# EAGLE design Serial-Basic (EAGLE 7.6.0)
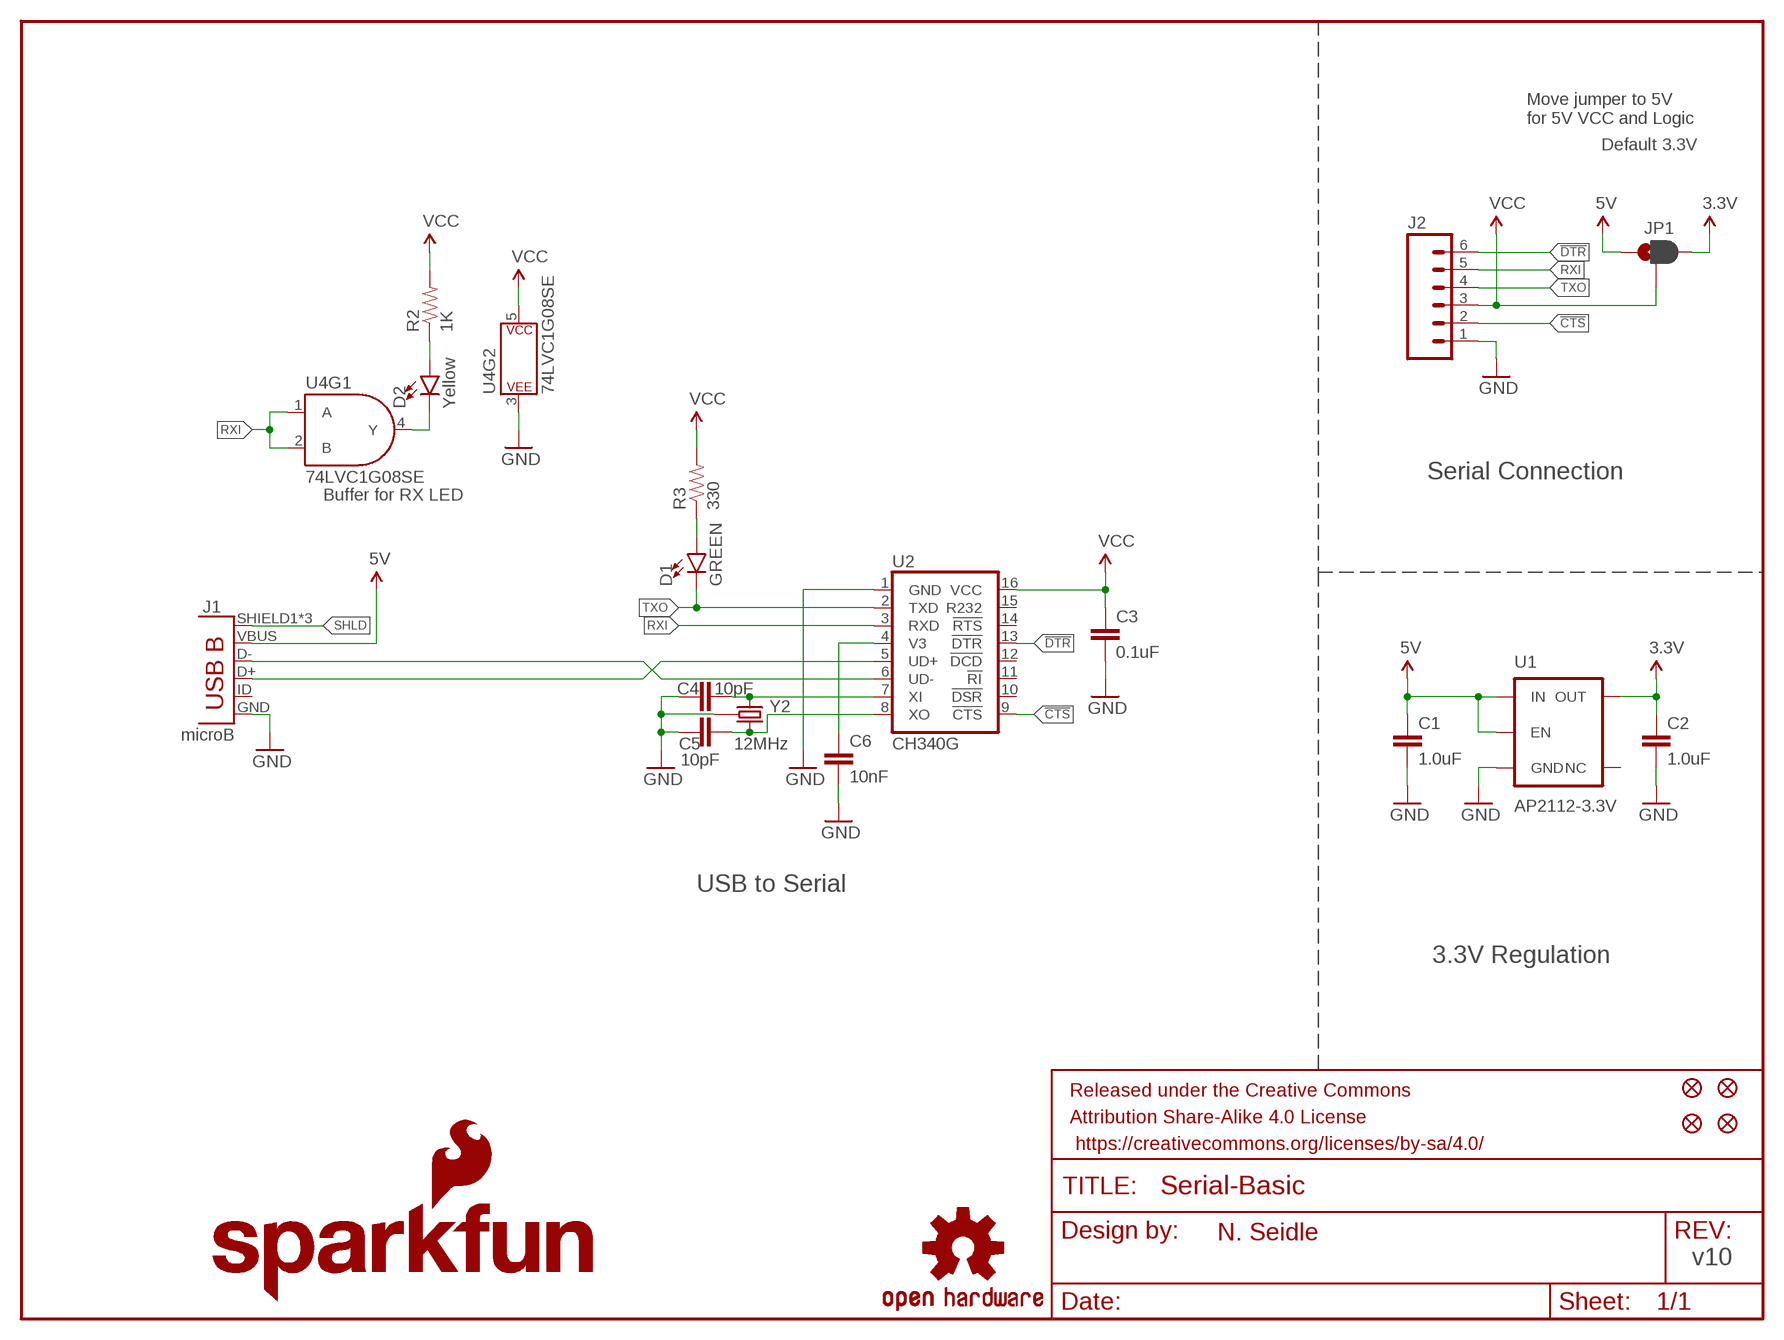
[diagram p0: schematic, sheet 1]

## Parts
C1  1.0uF  1.0UF-16V-10%(0603)  [0603-CAP]
C2  1.0uF  1.0UF-16V-10%(0603)  [0603-CAP]
C3  0.1uF  0.1UF-25V(+80/-20%)(0603)  [0603-CAP]
C4  10pF  10PF-50V-5%(0603)  [0603-CAP]
C5  10pF  10PF-50V-5%(0603)  [0603-CAP]
C6  10nF  10NF/10000PF-50V-10%(0603)  [0603-CAP]
D1  GREEN  LED-GREEN0603  [LED-0603]
D2  Yellow  LED-YELLOW0603  [LED-0603]
FRAME1  FRAME-LETTER  [CREATIVE_COMMONS]
J1  microB  USB-MICROB"  [USB-B-MICRO-SMD_V03]
J2  M06SMD-FEMALE-V2  [1X06-SMD-FEMALE-V2]
JP1  JUMPER-PAD-3-2OF3_NC_BY_PASTE  [PAD-JUMPER-3-2OF3_NC_BY_PASTE_YES_SILK_FULL_BOX]
JP3  FIDUCIAL1X2  [FIDUCIAL-1X2]
JP4  FIDUCIAL1X2  [FIDUCIAL-1X2]
JP5  FIDUCIAL1X2  [FIDUCIAL-1X2]
JP6  FIDUCIAL1X2  [FIDUCIAL-1X2]
LOGO1  OSHW-LOGOS  [OSHW-LOGO-S]
LOGO2  SFE_LOGO_FLAME.1_INCH  [SFE_LOGO_FLAME_.1]
LOGO3  SFE_LOGO_NAME.1_INCH  [SFE_LOGO_NAME_.1]
R2  1K  1KOHM-1/10W-1%(0603)  [0603-RES]
R3  330  330OHM1/10W1%(0603)  [0603-RES]
U1  AP2112-3.3V  V_REG_AP2112K-3.3V  [SOT23-5]
U2  CH340G  CH340GSMD  [SO016]
U4  74LVC1G08SE  7408  [SOT353]
Y2  12MHz  CRYSTAL-GROUNDED3.2X2.5  [CRYSTAL-SMD-3.2X2.5]

## Nets
3.3V [power]: C2.1 JP1.3 U1.5(OUT)
5V: C1.1 J1.VBUS JP1.1 U1.1(IN) U1.3(EN)
!CTS: J2.2 U2.9(!CTS)
!DTR: J2.6 U2.13(!DTR)
GND [power]: C1.2 C2.2 C3.2 C4.1 C5.1 C6.2 J1.GND J2.1 U1.2(GND) U2.1(GND) U4.3(P$V-) Y2.2(GND) Y2.4(GND)
N$1: D1.A R3.1
N$2: D2.A R2.1
N$3: C5.2 U2.8(XO) Y2.3
N$4: C4.2 U2.7(XI) Y2.1
N$5: D2.C U4.4(Y)
N$6: J1.D- U2.6(UD-)
N$7: J1.D+ U2.5(UD+)
RXI: J2.5 U2.3(RXD) U4.1(A) U4.2(B)
SHLD: J1.SHIELD1(SHIELD) J1.SHIELD2(SHIELD) J1.SHIELD3(SHIELD)
TXO: D1.C J2.4 U2.2(TXD)
V3: C6.1 U2.4(V3)
VCC: C3.1 J2.3 JP1.2 R2.2 R3.2 U2.16(VCC) U4.5(P$V+)
Unconnected: J1.ID(USBID) U1.4(NC) U2.10(!DSR) U2.11(!RI) U2.12(!DCD) U2.14(!RTS) U2.15(R232)

## Notes on the sheet
- Move jumper to 5V
  for 5V VCC and Logic
- Default 3.3V
- Serial Connection
- Buffer for RX LED
- USB to Serial
- 3.3V Regulation
- N. Seidle
- v10

## Library data of the parts
C1 C2 = SparkFun-Capacitors:1.0UF-16V-10%(0603): CAP-00868; PROD_ID: CAP-00868
C3 = SparkFun-Capacitors:0.1UF-25V(+80/-20%)(0603): CAP-00810 Ceramic Standard decoupling cap; PROD_ID: CAP-00810
C4 C5 = SparkFun-Capacitors:10PF-50V-5%(0603): CAP-11812; PROD_ID: CAP-11812
C6 = SparkFun-Capacitors:10NF/10000PF-50V-10%(0603): CAP-00867; PROD_ID: CAP-00867
D1 = SparkFun-LED:LED-GREEN: Green SMD LED Used in manufacturing of various products at SparkFun Packages: 0603 - SMD 0603 package [Product Link] <http://www.futureelectronics.com/en/technologies/semiconductors/optoelectronics/leds/Pages/9894312-LTST-C190GKT.aspx?CrossPart=HSMG-C190&IM=0> LilyPad 1206 - SMD1206 LilyPad package [Product Link] <http://www.futureelectronics.com/en/Technologies/Product.aspx?ProductID=IN150NGHARVATEKCORPORATION2049943&IM=0> 1206 - SMD1206 package [Product Link] <http://www.futureelectronics.com/en/technologies/semiconductors/optoelectronics/leds/Pages/8315665-LTST-C150KGKT.aspx?IM=0> 1206 Bottom Mount -SMD 1206 Bottom Mount [Product Link] <http://www.digikey.com/product-detail/en/lite-on-inc/LTST-C230KGKT/160-1456-1-ND/386854> SparkFun Products: Pro Mini 328 -5V <https://www.sparkfun.com/products/821> RedBoard <https://www.sparkfun.com/products/12757> MP3 Trigger <https://www.sparkfun.com/products/13720> Makey Makey <https://www.sparkfun.com/products/11076>; PROD_ID: DIO-00821
D2 = SparkFun-LED:LED-YELLOW: Yellow SMD LED Used in manufacturing several products at SparkFun. Packages: 0603 - SMD 0603 package[Product Link] <http://www.kingbrightusa.com/product.asp?catalog_name=LED&product_id=APT1608SYCK> 0603 -SMART - SMART SMD 0603 package (more efficient/more expensive) [Product Link] <http://www.osram-os.com/osram_os/en/products/product-catalog/led-light-emitting-diodes/smartled-0603/ly-l29k/index.jsp> LilyPad - SMD1206 package[Product Datasheet] <https://www.sparkfun.com/datasheets/DevTools/LilyPad/Q150YUS4.pdf> SparkFun Products: Blynk Board <https://www.sparkfun.com/products/13794> IOIO-OTG <https://www.sparkfun.com/products/13613> XBee Explorer Serial <https://www.sparkfun.com/products/13225>; PROD_ID: DIO-09003
FRAME1 = SparkFun-Aesthetics:FRAME-LETTER: Schematic Frame - Letter Standard 8.5x11 US Letter frame
J1 = SparkFun-Connectors:USB-MICROB; PROD_ID: CONN-11752
J2 = SparkFun-Connectors:M06: Header 6 Standard 6-pin 0.1" header. Use with straight break away headers (SKU : PRT-00116), right angle break away headers (PRT-00553), swiss pins (PRT-00743), machine pins (PRT-00117), and female headers (PRT-00115). Molex polarized connector foot print use with SKU : PRT-08094 with associated crimp pins and housings. NOTES ON THE VARIANTS LOCK and LOCK_LONGPADS... This footprint was designed to help hold the alignment of a through-hole component (i.e. 6-pin header) while soldering it into place. You may notice that each hole has been shifted either up or down by 0.005 of an inch from it's more standard position (which is a perfectly straight line). This slight alteration caused the pins (the squares in the middle) to touch the edges of the holes. Because they are alternating, it causes a "brace" to hold the component in place. 0.005 has proven to be the perfect amount of "off-center" position when using our standard breakaway headers. Although looks a little odd when you look at the bare footprint, once you have a header in there, the alteration is very hard to notice. Also,if you push a header all the way into place, it is covered up entirely on the bottom side. This idea of altering the position of holes to aid alignment will be further integrated into the Sparkfun Library for other footprints. It can help hold any component with 3 or more connection pins.; PROD_ID: CONN-09668
JP1 = SparkFun-Passives:JUMPER-PAD-3-2OF3_NC_BY_PASTE
JP3-JP6 = SparkFun:FIDUCIAL: Fiducial Alignment Points Various fiducial points for machine vision alignment.
LOGO1 = SparkFun-Aesthetics:OSHW-LOGO: Open-Source Hardware (OSHW) Logo This logo indicates the piece of hardware it is found on incorporates a OSHW license and/or adheres to the definition of open source hardware found here: http://freedomdefined.org/OSHW
LOGO2 = SparkFun-Aesthetics:SFE_LOGO_FLAME: SparkFun Flame Logo This is the SparkFun flame logo. The logo on the schematic will always be the same size; the package variant is the height of the flame. Default layer for the logo on the board is tSilk.
LOGO3 = SparkFun-Aesthetics:SFE_LOGO_NAME: SparkFun Font Logo This is the SparkFun name logo. The logo on the schematic will always be the same size; the package variant is the height of the flame part of the logo (or the height the flame would be, if it were drawn). Default layer for the logo on the board is tSilk.
R2 = SparkFun-Resistors:1KOHM-1/10W-1%(0603): RES-07856; PROD_ID: RES-07856
R3 = SparkFun-Resistors:330OHM1/10W1%(0603): RES-00818; PROD_ID: RES-00818
U1 = SparkFun-PowerIC:V_REG_AP2112: AP2112 - 600mA CMOS LDO Regulator w/ Enable The AP2112 is CMOS process low dropout linear regulator with enable function, the regulator delivers a guaranteed 600mA (min.) continuous load current. Features Output Voltage Accuracy: ±1.5% Output Current: 600mA (Min.) Foldback Short Current Protection: 50mA Enable Function to Turn ON/OFF VOUT Low Dropout Voltage (3.3V): 250mV (Typ.) @IOUT=600mA Excellent Load Regulation: 0.2%/A (Typ.) Excellent Line Regulation: 0.02%/V (Typ.) Low Quiescent Current: 55μA (Typ.) Low Standby Current: 0.01μA (Typ.) Low Output Noise: 50μVRMS PSRR: 100Hz -65dB, 1kHz -65dB OTSD Protection Stable with 1.0μF Flexible Cap: Ceramic, Tantalum and Aluminum Electrolytic Operation Temperature Range: -40°C to 85°C ESD: MM 400V, HBM 4000V; PROD_ID: VREG-12457; VALUE: 3.3V
U2 = SparkFun-DigitalIC:CH340G: A simple USB 2.0 to Serial IC.; PROD_ID: IC-13498
U4 = Serial-Basic:74*08: Single AND gate IC GATE AND SNGL 2INPUT SOT353 SparkFun Products SparkFun LogicBlocks Kit <https://www.sparkfun.com/products/11006> (KIT-11006) SparkFun RedBot Mainboard <https://www.sparkfun.com/products/12097> (ROB-12097); PROD_ID: IC-10841
Y2 = USB Basic:CRYSTAL-GROUNDED: Small, 3.2x2.5mm, SMD Crystal; PROD_ID: XTAL-13518

## Net classes
1 power: width 0.178 mm

## Board
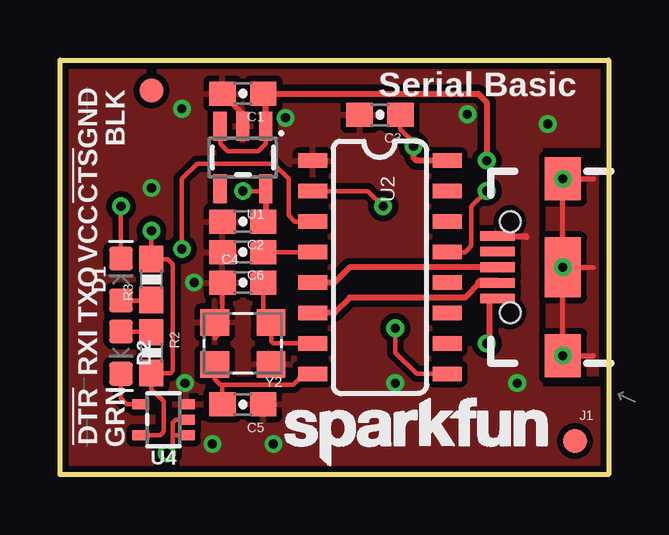
[diagram p1: board, top side]
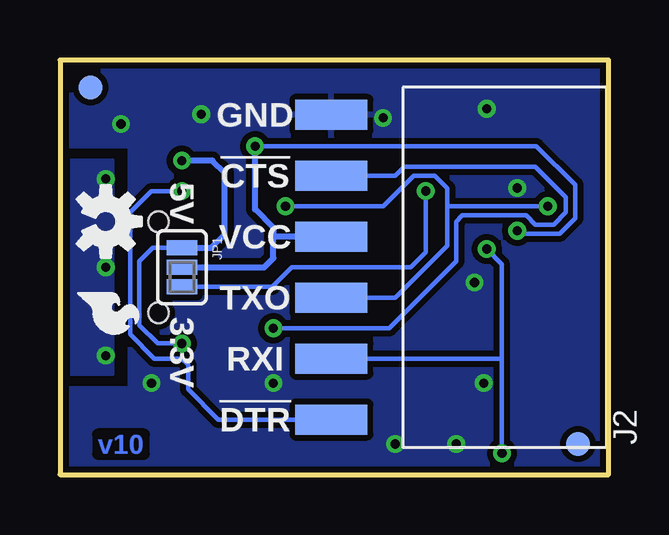
[diagram p2: board, bottom side, seen from below]

Size 22.86 x 17.27 mm. Coordinates in mm from the lower left corner, seen from the top.
Outline: 0,17.27 22.86,17.27 22.86,0 0,0 0,17.27
Copper layers (1*16): Top 0.035mm / dielectric 1.5mm / Bottom 0.035mm
Design rules "SparkFun-2-layer-TIGHT": minimum track width 7mil, minimum drill 15mil, track to track 7mil, track to pad 7mil, pad to pad 7mil, via to via 7mil, smd to smd 7mil, copper to edge 7mil, drill to drill 7mil, minimum pad ring 7mil, minimum via ring 7mil, stop-mask expansion 4mil, vias tented up to drill 20mil, thermal gap 10mil

### Footprints (pad centres in the part's own frame; a part is rotated, then mirrored left to right if it is on the bottom)
0603-CAP = smd 1.1 x 1: 1 -0.85,0; 2 0.85,0
LED-0603 = smd 1 x 1: A -0.877,0; C 0.877,0
USB-B-MICRO-SMD_V03 = smd 1.45 x 0.4: D+ 2.725,0; D- 2.725,0.65; GND 2.725,-1.3; ID 2.725,-0.65; VBUS 2.725,1.3 | smd 1.5 x 1.8: SHIELD1 0,3.685; SHIELD2 0,-3.685 | smd 1.5 x 2.5: SHIELD3 0,0 | hole 0.85: 2.2,1.9; 2.2,-1.9
1X06-SMD-FEMALE-V2 = smd 1.25 x 3: 1 6.35,3.425; 2 3.81,3.425; 3 1.27,3.425; 4 -1.27,3.425; 5 -3.81,3.425; 6 -6.35,3.425
PAD-JUMPER-3-2OF3_NC_BY_PASTE_YES_SILK_FULL_BOX = smd 0.635 x 1.27: 1 -0.813,0; 2 0,0; 3 0.813,0
FIDUCIAL-1X2 = smd 1 x 1: 1 0,0
0603-RES = smd 1.1 x 1: 1 -0.85,0; 2 0.85,0
SOT23-5 = smd 0.55 x 1.2: 1 -0.95,-1.3; 2 0,-1.3; 3 0.95,-1.3; 4 0.95,1.3; 5 -0.95,1.3
SO016 = smd 0.6 x 1.2: 1 -4.445,-2.8; 2 -3.175,-2.8; 3 -1.905,-2.8; 4 -0.635,-2.8; 5 0.635,-2.8; 6 1.905,-2.8; 7 3.175,-2.8; 8 4.445,-2.8; 9 4.445,2.8; 10 3.175,2.8; 11 1.905,2.8; 12 0.635,2.8; 13 -0.635,2.8; 14 -1.905,2.8; 15 -3.175,2.8; 16 -4.445,2.8
SOT353 = smd 0.42 x 0.7: 1 -0.65,-0.95; 2 0,-0.95; 3 0.65,-0.95; 4 0.65,0.95; 5 -0.65,0.95
CRYSTAL-SMD-3.2X2.5 = smd 1.2 x 1.1: 1 -1.175,-0.875; 2 1.175,-0.875; 3 1.175,0.875; 4 -1.175,0.875

### Placement (x,y rotation side)
C1  7.62,15.88 180 top
C2  7.62,10.54 180 top
C3  13.34,14.99 180 top
C4  7.62,8 0 top
C5  7.62,2.92 180 top
C6  7.62,9.27 180 top
D1  2.54,8.13 90 top
D2  2.54,5.08 270 top
FRAME1  -8.31,-17.78 0 top  (outside the outline)
J1  20.95,8.64 180 top
J2  8.13,8.64 90 bottom
JP1  17.78,8.64 270 bottom
JP3  3.81,16 0 top
JP4  21.46,1.4 0 top
JP5  1.27,1.27 0 bottom
JP6  21.59,16.13 0 bottom
LOGO1  20.95,10.54 270 bottom
LOGO2  22.48,7.87 270 bottom
LOGO3  8.89,-0.13 0 top
R2  3.81,5.08 270 top
R3  3.81,8.13 90 top
U1  7.62,13.21 180 top
U2  13.34,8.64 270 top
U4  4.32,2.29 90 top
Y2  7.62,5.46 180 top

### Tracks (layer width: path | path; a pad name or v marks a point on that pad's centre or on a via)
3.3V  (via drill 0.38)
  Top 0.178: v7.62,11.81 8.54,11.81
  Top 0.254: C2.1 8.57,10.64 U1.5 8.54,11.88 8.54,11.81
  Bottom 0.178: v7.62,11.81 7.62,9.27 8.26,8.64 13.21,8.64 14.02,7.82 JP1.3
5V  (via drill 0.38)
  Top 0.178: U1.1 8.57,13.78 8.26,13.46 6.99,13.46 6.67,13.78 U1.3
  Top 0.254: v17.78,13.08 17.78,15.52 17.43,15.88 C1.1 8.57,15.78 U1.1 | J1.VBUS 17.88,7.34 17.88,5.56 v17.78,5.46
  Bottom 0.178: JP1.1 19,9.45 19.56,8.89 19.56,6.22 18.8,5.46 v17.78,5.46
  Bottom 0.254: v17.78,13.08 16.51,13.08 16,12.57 16,10 16.55,9.45 JP1.1
!CTS  (via drill 0.38)
  Top 0.178: U2.9 14.86,4.19 13.97,5.08 v13.97,6.1
  Bottom 0.178: v13.97,6.1 9.14,6.1 6.35,8.89 6.35,10.54 6.1,10.79 3.43,10.79 3.05,10.41 2.29,10.41 1.78,10.92 1.78,11.56 3.05,12.83 8.51,12.83 8.89,12.45 J2.2
!DTR  (via drill 0.38)
  Top 0.178: v17.78,11.81 17.14,11.18 17.14,9.53 16.89,9.27 U2.13
  Bottom 0.178: v17.78,11.81 19.05,11.81 19.94,10.92 19.94,5.84 18.92,4.83 17.78,4.83 17.53,4.57 17.53,3.56 16.26,2.29 J2.6
GND  (via drill 0.38)
  Top 0.178: C4.1 6.77,6.01 6.45,5.68 Y2.2
  Top 0.254: 19.43,9.91 19.4,9.94 J1.GND | U1.2 7.62,15.03 C1.2
  other vias: 16.98,15.01 5.08,15.24 13.97,3.81 5.59,8 20.32,14.61 19.05,3.81 8.89,1.27 9.4,14.86 3.81,11.94 6.35,1.27 5.21,3.81
  pour Bottom (isolate 0.254): 0,-0.03 0,17.27 22.86,17.27 22.86,13.72 19.94,13.72 19.94,3.56 22.86,3.56 22.86,-0.03
  pour Top (isolate 0.254, rank 2): 0,-0.03 0,17.27 22.86,17.27 22.86,13.72 19.98,13.72 19.98,3.56 22.86,3.56 22.86,-0.03
N$1
  Top 0.178: D1.A 3.78,7.25 R3.1
N$2
  Top 0.178: D2.A 3.78,5.96 R2.1
N$3
  Top 0.178: 6.79,3.75 6.67,3.75 6.45,3.97 Y2.3 | C5.2 6.77,3.72 6.79,3.75 | U2.8 10.16,4.19 9.72,3.75 6.79,3.75
N$4
  Top 0.178: U2.7 8.89,5.46 8.79,5.56 Y2.1 8.47,6.66 C4.2
N$5
  Top 0.178: D2.C 2.54,3.17 2.78,2.94 U4.4
N$6
  Top 0.254: U2.6 11.43,6.73 12.06,7.37 16.88,7.37 17.5,7.99
  Top 0.406: J1.D- 17.5,7.99
N$7
  Top 0.254: J1.D+ 12.06,8.64 11.43,8 U2.5
RXI  (via drill 0.38)
  Top 0.178: U2.3 9.78,10.54 9.53,10.79 9.53,12.32 8.89,12.95 5.71,12.95 5.08,12.32 v5.08,9.4 | U4.2 4.83,2.29 4.7,2.16 4.7,1.65 | 4.7,1.65 4.7,1.14 v4.45,0.89 | U4.1 4.71,1.64 4.7,1.65
  Bottom 0.178: J2.5 4.45,4.83 | v5.08,9.4 4.45,8.76 4.45,4.83 | 4.45,4.83 v4.45,0.89
SHLD  (via drill 0.38)
  Top 0.203: J1.SHIELD3 22.23,8.64 | 22.23,12.32 J1.SHIELD2 J1.SHIELD1 22.23,4.95
  other vias: 20.95,12.32 20.95,8.64 20.95,4.95
  pour Top (isolate 0.305): 22.86,12.7 20.32,12.7 20.32,4.19 22.86,4.19
  pour Bottom (isolate 0.305): 22.86,13.08 20.7,13.08 20.7,4.19 22.86,4.19
TXO  (via drill 0.38)
  Top 0.178: U2.2 12.83,11.81 v13.46,11.18 | v2.54,11.18 D1.C
  Bottom 0.178: v13.46,11.18 9.4,11.18 8.13,12.45 7.24,12.45 6.73,11.94 6.73,11.18 | J2.4 8.89,7.37 6.73,9.53 6.73,11.18 | v2.54,11.18 6.73,11.18
V3
  Top 0.178: U2.4 C6.1
VCC  (via drill 0.38)
  Top 0.178: C3.1 14.19,14.39 14.73,13.84 v14.73,13.68 | U4.5 4.18,1.64 4.32,1.78 4.32,3.05 3.81,3.56 R2.2 4.61,4.23 4.7,4.32 4.7,8.76 4.48,8.98 R3.2 v3.81,10.16
  Top 0.254: U2.16 14.85,13.08 14.73,13.2 v14.73,13.68
  Bottom 0.178: v14.73,13.68 3.01,13.68 1.4,12.06 1.4,10.67 2.03,10.03 3.68,10.03 v3.81,10.16
  Bottom 0.254: J2.3 13.97,9.91 | JP1.2 14.35,8.64 13.97,9.02 13.97,9.91 | 13.97,9.91 13.97,10.29 14.73,11.05 v14.73,13.68

### Text on the board
Bottom: v10
tPlace: Serial Basic | GND | BLK | !CTS | VCC | TXO | RXI | !DTR | GRN
bPlace: GND | !CTS | 5V | VCC | TXO | RXI | 3.3V | !DTR
tValues: Close
Measures: All dimensions in inches
tDocu: N. Seidle